# Altium schematic sheet Charger.SchDoc
size A4; SheetNumber: 1; SheetTotal: 1
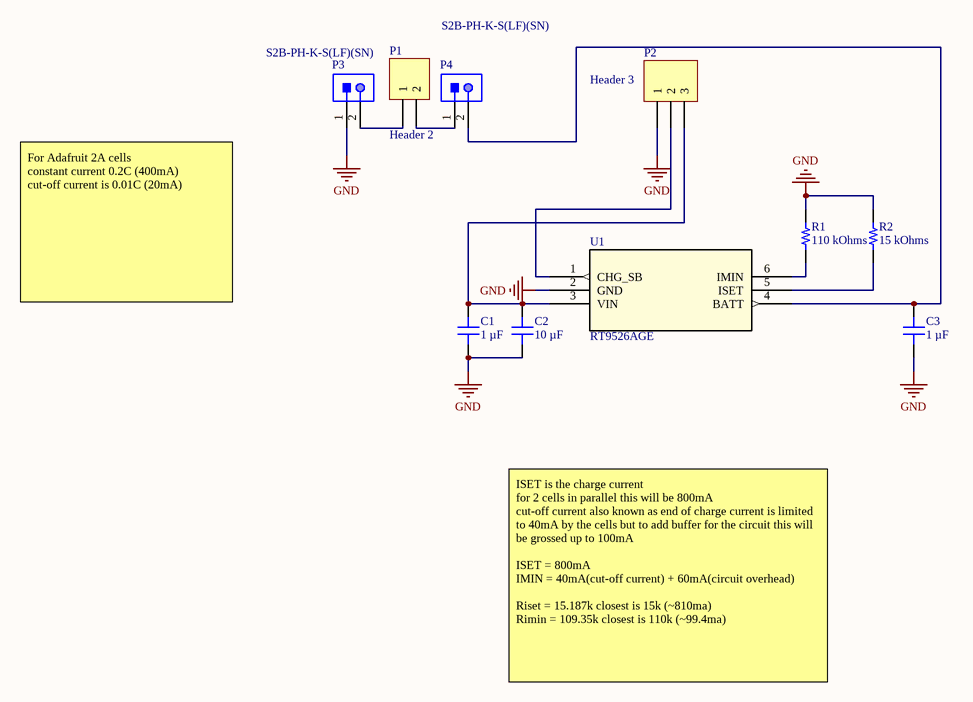
[diagram p0: Charger.SchDoc]

## Parts
C1  1 µF  [CAP 0603_1608]
C2  10 µF  [CAP 0603_1608]
C3  1 µF  [CAP 0603_1608]
P1  Header 2  [HDR1X2]
P2  Header 3  [HDR1X3]
P3  S2B-PH-K-S(LF)(SN)  [JST-S2B-PH-K-S_V]
P4  S2B-PH-K-S(LF)(SN)  [JST-S2B-PH-K-S_V]
R1  110 kOhms  [RES 0805_2012]
R2  15 kOhms  [RES 0805_2012]
U1  RT9526AGE  [SOT-23-6_RIT]

## Nets
GND: C1.1 C2.1 C3.1 P2.1 P3.1 R1.2 R2.2 U1.2(GND)
NetC1_2: C1.2 C2.2 P2.3 U1.3(VIN)
NetC3_2: C3.2 P4.2 U1.4(BATT)
NetP1_1: P1.1 P3.2
NetP1_2: P1.2 P4.1
NetP2_2: P2.2 U1.1(CHG_SB)
NetR1_1: R1.1 U1.6(IMIN)
NetR2_1: R2.1 U1.5(ISET)

## Notes on the sheet
- For Adafruit 2A cells
  constant current 0.2C (400mA)
  cut-off current is 0.01C (20mA)
- ISET is the charge current
  for 2 cells in parallel this will be 800mA
  cut-off current also known as end of charge current is limited to 40mA by the cells but to add buffer for the circuit this will be grossed up to 100mA
  ISET = 800mA
  IMIN = 40mA(cut-off current) + 60mA(circuit overhead)
  Riset = 15.187k closest is 15k (~810ma)
  Rimin = 109.35k closest is 110k (~99.4ma)

## Library data of the parts
C1 C3 = C1608X7R1C105K080AC: CAP CER 1UF 16V X7R 0603; manufacturer: TDK Corporation; Tolerance: ±10%; Part Number: C1608X7R1C105K080AC; Value: 1 µF; Applications: General Purpose; Capacitance: 1 µF; componentlink1description: Datasheet; componentlink1url: https://product.tdk.com/info/en/catalog/datasheets/mlcc_commercial_general_en.pdf?ref_disty=digikey; componentlink2description: DigiKey Link; componentlink2url: https://www.digikey.com/en/products/detail/tdk-corporation/C1608X7R1C105K080AC/634395; Device Package: 0603 (1608 Metric); Features: Low ESL; lastupdated: 2023-01-03 8:06:54 PM; Lifecycle Status: Active; Minimum Order: 1; Mounting Type: Surface Mount, MLCC; Operating Temperature: -55°C ~ 125°C; Package / Case: 0603 (1608 Metric); packaging: TapeAndReel; partid: 36324; Part Status: Active; price: 0.01; series: C; Size / Dimension: 0.063" L x 0.031" W (1.60mm x 0.80mm); Supplier 1: DigiKey; Supplier Part Number 1: 445-1604-1-ND; Temperature Coefficient: X7R; Thickness (Max): 0.035" (0.90mm); Voltage - Rated: 16V
C2 = GRM188R61E106KA73J: CAP CER 10UF 25V X5R 0603; manufacturer: Murata Electronics; Tolerance: ±10%; Part Number: GRM188R61E106KA73J; Value: 10 µF; Applications: General Purpose; Capacitance: 10 µF; componentlink1description: Datasheet; componentlink1url: https://search.murata.co.jp/Ceramy/image/img/A01X/G101/ENG/GRM188R61E106KA73-01A.pdf; componentlink2description: DigiKey Link; componentlink2url: https://www.digikey.com/en/products/detail/murata-electronics/GRM188R61E106KA73J/9887674; Device Package: 0603 (1608 Metric); lastupdated: 2023-01-03 8:06:37 PM; Lifecycle Status: Active; Minimum Order: 1; Mounting Type: Surface Mount, MLCC; Operating Temperature: -55°C ~ 85°C; Package / Case: 0603 (1608 Metric); packaging: TapeAndReel; partid: 39529; Part Status: Active; price: 0.04; series: GRM; Size / Dimension: 0.063" L x 0.031" W (1.60mm x 0.80mm); Supplier 1: DigiKey; Supplier Part Number 1: 490-GRM188R61E106KA73JCT-ND; Temperature Coefficient: X5R; Thickness (Max): 0.039" (1.00mm); Voltage - Rated: 25V
P1 = Header 2: Header, 2-Pin; LatestRevisionDate: 17-Jul-2002; LatestRevisionNote: Re-released for DXP Platform.; Publisher: Altium Limited
P2 = Header 3: Header, 3-Pin; LatestRevisionDate: 17-Jul-2002; LatestRevisionNote: Re-released for DXP Platform.; Publisher: Altium Limited
P3 P4 = CMP-1755-00004-1: Male Header, Pitch 2 mm, 1 x 2 Position, Height 4.8 mm, Tail Length 3.4 mm, -25 to 85 degC, RoHS, Bulk; Case\Package: Radial; Tolerance: 20%; Capacitance: 10 uF; Voltage Rating (DC): 50 V; Packaging: Bulk; ComponentLink1URL: http://www.jst-mfg.com/product/pdf/eng/ePH.pdf; Radiation Hardening: No; Height: 11 mm; Package Quantity: 200; PackageDescription: Male Header, Pitch 2 mm, 1 x 2 Position, Height 4.8 mm, Tail Length 3.4 mm; PackageReference: S2B-PH-K-S; Diameter: 5 mm; Pins: 2; Mount: Through Hole; Max Operating Temperature: 85 degC; Min Operating Temperature: -40 degC; ComponentLink1Description: Datasheet; DatasheetVersion: Dec-12; Length: 11 mm; Lead Pitch: 2 mm; REACH SVHC: No SVHC; Voltage Rating: 50 V; RoHSCompliant: true
R1 = RC0805FR-07110KL: RES 110K OHM 1% 1/8W 0805; Manufacturer: Yageo; Power (Watts): 0.125W, 1/8W; Temperature Coefficient: ±100ppm/°C; Part Number: RC0805FR-07110KL; Value: 110 kOhms; ComponentLink1Description: Datasheet; ComponentLink1URL: https://www.yageo.com/upload/media/product/productsearch/datasheet/rchip/PYu-RC_Group_51_RoHS_L_10.pdf; ComponentLink2Description: DigiKey Link; ComponentLink2URL: https://www.digikey.com/en/products/detail/yageo/RC0805FR-07110KL/727560; Composition: Thick Film; Device Package: 0805 (2012 Metric); Features: Moisture Resistant; Height - Seated (Max): 0.024" (0.60mm); LastUpdated: 2023-01-02 8:44:02 PM; Lifecycle Status: Active; Minimum Order: 1; Number of Terminations: 2; Operating Temperature: -55°C ~ 155°C; Package / Case: 0805 (2012 Metric); Packaging: CutTape; PartId: 39573; Part Status: Active; Price: 0.01; Resistance: 110 kOhms; Series: RC_L; Size / Dimension: 0.079" L x 0.049" W (2.00mm x 1.25mm); Supplier 1: DigiKey; Supplier Part Number 1: 311-110KCRCT-ND; Supplier Device Package: 0805; Tolerance: ±1%
R2 = RC0805FR-1315KL: RES 15K OHM 1% 1/8W 0805; Manufacturer: Yageo; Power (Watts): 0.125W, 1/8W; Temperature Coefficient: ±100ppm/°C; Part Number: RC0805FR-1315KL; Value: 15 kOhms; ComponentLink1Description: Datasheet; ComponentLink1URL: https://www.yageo.com/upload/media/product/productsearch/datasheet/rchip/PYu-RC_Group_51_RoHS_L_11.pdf; ComponentLink2Description: DigiKey Link; ComponentLink2URL: https://www.digikey.com/en/products/detail/yageo/RC0805FR-1315KL/13694228; Composition: Thick Film; Device Package: 0805 (2012 Metric); Features: Moisture Resistant; Height - Seated (Max): 0.024" (0.60mm); LastUpdated: 2023-01-02 8:42:49 PM; Lifecycle Status: Active; Minimum Order: 1; Number of Terminations: 2; Operating Temperature: -55°C ~ 155°C; Package / Case: 0805 (2012 Metric); Packaging: CutTape; PartId: 66554; Part Status: Active; Price: 0.01; Resistance: 15 kOhms; Series: RC_L; Size / Dimension: 0.079" L x 0.049" W (2.00mm x 1.25mm); Supplier 1: DigiKey; Supplier Part Number 1: 13-RC0805FR-1315KLCT-ND; Supplier Device Package: 0805; Tolerance: ±1%
U1 = RT9526AGE: No Description Available; Mfr_Name: Richtek Technology; Copyright: Copyright (C) 2023 Ultra Librarian. All rights reserved.; Manufacturer_Part_Number: RT9526AGE; Digi-Key_Part_Number_1: 1028-1359-2-ND; Digi-Key_Part_Number_2: 1028-1359-1-ND; Digi-Key_Part_Number_3: 1028-1359-6-ND; RefDes: RefDes; Type: DEV